# EasyEDA schematic 1-Schematic_8052Explorer_JOLLY.json
TITLE: Sheet_1; REV: 1.0; Date: 2021-05-03; Sheet: 1/1; Drawn By: bigjohnson; Company: Your Company
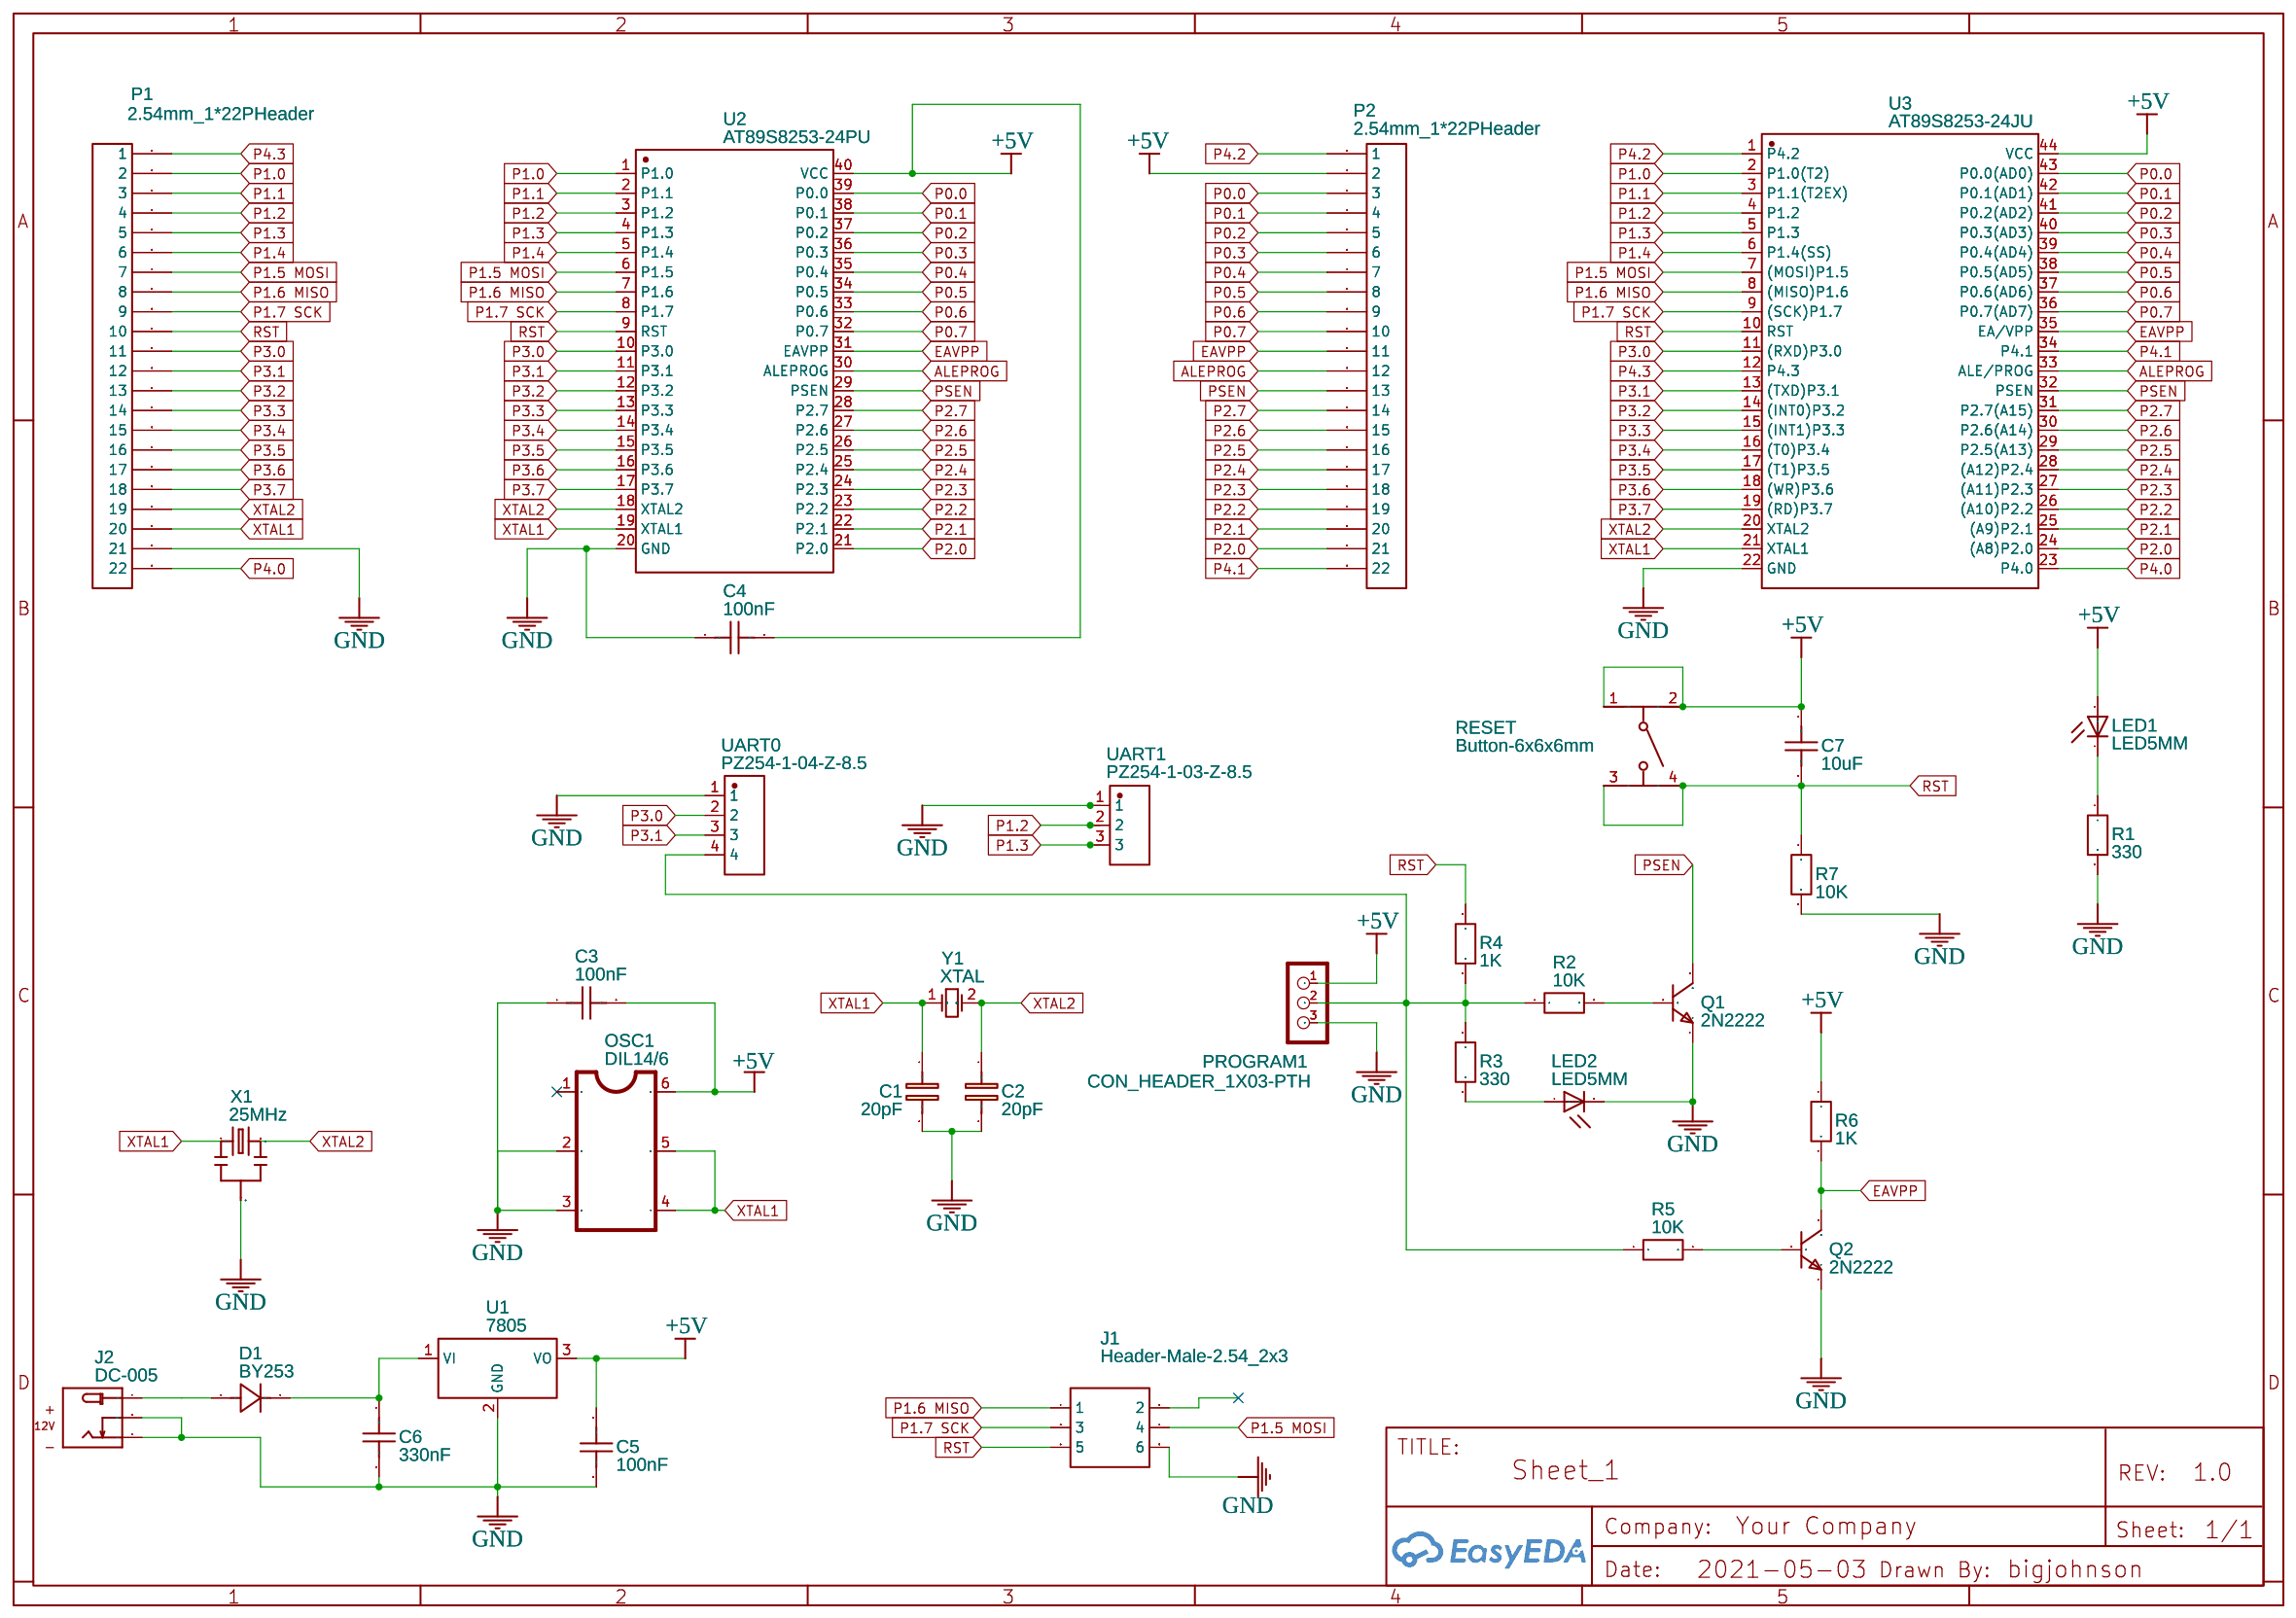
[diagram p0: schematic sheet]

## Parts
C1  20pF  [CAPASITOR (K10-17Б), 15PF, 50V, 10%]
C2  20pF  [CAPASITOR (K10-17Б), 15PF, 50V, 10%]
C3  100nF  [CAP-TH_L4.2-W3.8-P5.08-D0.6]
C4  100nF  [CAP-TH_L4.2-W3.8-P5.08-D0.6]
C5  100nF  [CAP-TH_L4.2-W3.8-P5.08-D0.6]
C6  330nF  [CAP-TH_L4.2-W3.8-P5.08-D0.6]
C7  10uF  [CAP-TH_L4.2-W3.8-P5.08-D0.6]
D1  BY253  [DO-201_BD5.1-L8.4-P15.24-D1.0-RD]
J1  Header-Male-2.54_2x3  [HDR-TH_6P-P2.54-V-R2-C3-S2.54]
J2  DC-005  [DCJ3P-14.2X11.0X9.0MM]
LED1  LED5MM  [LED5MM]
LED2  LED5MM  [LED5MM]
OSC1  DIL14/6  [DIP14]
P1  2.54mm_1*22PHeader  [HDR-22X1/2.54]
P2  2.54mm_1*22PHeader  [HDR-22X1/2.54]
PROGRAM1  CON_HEADER_1X03-PTH  [M1X3]
Q1  2N2222  [TO-92-3_L4.9-W3.7-P1.27-L]
Q2  2N2222  [TO-92-3_L4.9-W3.7-P1.27-L]
R1  330  [AXIAL-0.4]
R2  10K  [AXIAL-0.4]
R3  330  [AXIAL-0.4]
R4  1K  [AXIAL-0.4]
R5  10K  [AXIAL-0.4]
R6  1K  [AXIAL-0.4]
R7  10K  [AXIAL-0.4]
RESET  Button-6x6x6mm  [SW-TH_4P-L6.0-W6.0-P4.50-LS6.1]
U1  7805  [TO-220]
U2  AT89S8253-24PU  [DIP-40_L50.8-W17.8-P2.54-LS15.2-BL]
U3  AT89S8253-24JU  [PLCC 44]
UART0  PZ254-1-04-Z-8.5  [HDR-TH_4P-P2.54-V-M]
UART1  PZ254-1-03-Z-8.5  [HDR-TH_03P-P2.54-V-M]
X1  25MHz  [RESONATOR-PTH]
Y1  XTAL  [XTAL1]

## Library data of the parts
C1 C2 = 20pF copy: Supplier Part: 9000274010; Contributor: seldomorama; link: https://www.chipdip.ru/product0/9000447523
C3-C7 = CT4-0805B103 K500: Supplier: LCSC; Manufacturer: ReliaPro; Supplier Part: C8033
D1 = MUR460_C2990844: Supplier: LCSC; Supplier Part: C2990844; Manufacturer: GOOD-ARK(固锝); Manufacturer Part: MUR460; JLCPCB Part Class: Extended Part; Contributor: lcsc
J1 = Header-Male-2.54_2x3: Supplier: LCSC; Manufacturer: BOOMELE; Supplier Part: C65114; LCSC Assembly: Yes; SMT Type: Extend; Paste Type: expand
J2 = DC-005: CONN DC POWER JACK 2.1MM
LED1 LED2 = LED5MM: LEDs; Contributor: Pinoccio
OSC1 = DIL14/3: Universal 14pins IC; Contributor: bigjohnson
P1 P2 = 2.54mm_1*22PHeader: Supplier Part: C50981; Supplier: LCSC; Manufacturer: BOOMELE; Manufacturer Part: 2.54mm 1*22PHeader; image: //image.lceda.cn/szlcsc/C50981.jpg; Contributor: daansteeman
PROGRAM1 = CON_HEADER_1X03-PTH: Contributor: DangerousPrototype
Q1 Q2 = 2N2222: Supplier: LCSC; Manufacturer: SEMTECH; Contributor: LCSC; Supplier Part: C118536; LCSC Assembly: Yes; SMT Type: Extend; Paste Type: expand
R1-R7 = Res_AXIAL-0.4(1/4W)_EU
RESET = Button-6x6x6mm: Supplier Part: C71836; Supplier: LCSC; Manufacturer: BBJ; Manufacturer Part: Switch,6*6*6Plastic head,260G, 0.25mm,Straight line
U1 = 7805: Supplier: LCSC; Supplier Part: C305416; Manufacturer: Foshan Blue Rocket Elec; Contributor: Gerardo Trejo-Larin
U2 = AT89S8253-24PU: Contributor: Joseph Hankuba
U3 = AT89S8253-24JU: Supplier: LCSC; Supplier Part: C614054; Manufacturer: null; Contributor: LCSC
UART0 = PZ254-1-04-Z-8.5: Supplier: LCSC; Supplier Part: C2894927; Manufacturer: HCTL(华灿天禄); Contributor: LCSC; JLCPCB Part Class: Extended Part
UART1 = PZ254-1-03-Z-8.5: Supplier: LCSC; Supplier Part: C2894926; Manufacturer: HCTL(华灿天禄); Contributor: LCSC; JLCPCB Part Class: Extended Part
X1 = Ceramic Resonator 16 MHz: Supplier Part: C71016; Supplier: LCSC; Manufacturer: YXC; Manufacturer Part: Resonator 433.92MHZ; Contributor: LCSC
Y1 = XTAL: Crystal Oscillator

## Nets
+5V: C3.2 C4.2 C5.1 C7.1 LED1.A OSC1.6 P2.2 PROGRAM1.1 R6.1 RESET.1 RESET.2 U1.3(VO) U2.40(VCC) U3.44(VCC)
GND: C1.2(1) C2.2(1) C3.1 C4.1 C5.2 C6.2 J1.6 J2.-1(-) J2.-2(CDN) LED2.K(C) OSC1.2 OSC1.3 P1.21 PROGRAM1.3 Q1.1(E) Q2.1(E) R1.2 R7.2 U1.2(GND) U2.20(GND) U3.22(GND) UART0.1 UART1.1 X1.2
ALEPROG: P2.12 U2.30(ALEPROG) U3.33(ALE/PROG)
EAVPP: P2.11 Q2.3(C) R6.2 U2.31(EAVPP) U3.35(EA/VPP)
P0.0: P2.3 U2.39(P0.0) U3.43(P0.0(AD0))
P0.1: P2.4 U2.38(P0.1) U3.42(P0.1(AD1))
P0.2: P2.5 U2.37(P0.2) U3.41(P0.2(AD2))
P0.3: P2.6 U2.36(P0.3) U3.40(P0.3(AD3))
P0.4: P2.7 U2.35(P0.4) U3.39(P0.4(AD4))
P0.5: P2.8 U2.34(P0.5) U3.38(P0.5(AD5))
P0.6: P2.9 U2.33(P0.6) U3.37(P0.6(AD6))
P0.7: P2.10 U2.32(P0.7) U3.36(P0.7(AD7))
P1.0: P1.2 U2.1(P1.0) U3.2(P1.0(T2))
P1.1: P1.3 U2.2(P1.1) U3.3(P1.1(T2EX))
P1.2: P1.4 U2.3(P1.2) U3.4(P1.2) UART1.2
P1.3: P1.5 U2.4(P1.3) U3.5(P1.3) UART1.3
P1.4: P1.6 U2.5(P1.4) U3.6(P1.4(SS))
P1.5 MOSI: J1.4 P1.7 U2.6(P1.5) U3.7((MOSI)P1.5)
P1.6 MISO: J1.1 P1.8 U2.7(P1.6) U3.8((MISO)P1.6)
P1.7 SCK: J1.3 P1.9 U2.8(P1.7) U3.9((SCK)P1.7)
P2.0: P2.21 U2.21(P2.0) U3.24((A8)P2.0)
P2.1: P2.20 U2.22(P2.1) U3.25((A9)P2.1)
P2.2: P2.19 U2.23(P2.2) U3.26((A10)P2.2)
P2.3: P2.18 U2.24(P2.3) U3.27((A11)P2.3)
P2.4: P2.17 U2.25(P2.4) U3.28((A12)P2.4)
P2.5: P2.16 U2.26(P2.5) U3.29(P2.5(A13))
P2.6: P2.15 U2.27(P2.6) U3.30(P2.6(A14))
P2.7: P2.14 U2.28(P2.7) U3.31(P2.7(A15))
P3.0: P1.11 U2.10(P3.0) U3.11((RXD)P3.0) UART0.2
P3.1: P1.12 U2.11(P3.1) U3.13((TXD)P3.1) UART0.3
P3.2: P1.13 U2.12(P3.2) U3.14((INT0)P3.2)
P3.3: P1.14 U2.13(P3.3) U3.15((INT1)P3.3)
P3.4: P1.15 U2.14(P3.4) U3.16((T0)P3.4)
P3.5: P1.16 U2.15(P3.5) U3.17((T1)P3.5)
P3.6: P1.17 U2.16(P3.6) U3.18((WR)P3.6)
P3.7: P1.18 U2.17(P3.7) U3.19((RD)P3.7)
P4.0: P1.22 U3.23(P4.0)
P4.1: P2.22 U3.34(P4.1)
P4.2: P2.1 U3.1(P4.2)
P4.3: P1.1 U3.12(P4.3)
PSEN: P2.13 Q1.3(C) U2.29(PSEN) U3.32(PSEN)
RST: C7.2 J1.5 P1.10 R4.1 R7.1 RESET.3 RESET.4 U2.9(RST) U3.10(RST)
XTAL1: C1.1 OSC1.4 OSC1.5 P1.20 U2.19(XTAL1) U3.21(XTAL1) X1.1 Y1.1(OSC1)
XTAL2: C2.1 P1.19 U2.18(XTAL2) U3.20(XTAL2) X1.3 Y1.2(OSC2)
Net-(C6-1): C6.1 D1.1(K) U1.1(VI)
Net-(D1-2): D1.2(A) J2.+
Net-(LED1-K): LED1.K(C) R1.1
Net-(LED2-A): LED2.A R3.2
Net-(PROGRAM1-2): PROGRAM1.2 R2.1 R3.1 R4.2 R5.1 UART0.4
Net-(Q1-2): Q1.2(B) R2.2
Net-(Q2-2): Q2.2(B) R5.2

Not connected (* = marked no-connect by the designer): J1 2; OSC1 1*
